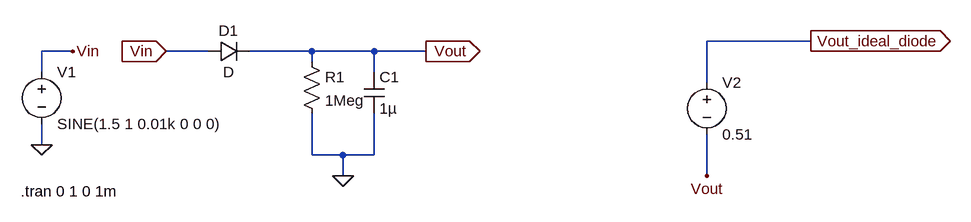
[diagram p0: schematic Peak detector Comm sys.asc]
Peak detector Comm sys.asc, the LTspice schematic file:
Version 4
SHEET 1 1344 680
WIRE 1040 96 880 96
WIRE -96 112 -144 112
WIRE 112 112 48 112
WIRE 272 112 176 112
WIRE 368 112 272 112
WIRE 448 112 368 112
WIRE 272 128 272 112
WIRE -144 144 -144 112
WIRE 368 144 368 112
WIRE 880 160 880 96
WIRE -144 256 -144 224
WIRE 272 272 272 208
WIRE 320 272 272 272
WIRE 368 272 368 208
WIRE 368 272 320 272
WIRE 320 304 320 272
WIRE 880 304 880 240
FLAG 320 304 0
FLAG 448 112 Vout
IOPIN 448 112 Out
FLAG 48 112 Vin
IOPIN 48 112 In
FLAG -144 256 0
FLAG -96 112 Vin
FLAG 880 304 Vout
FLAG 1040 96 Vout_ideal_diode
IOPIN 1040 96 Out
SYMBOL diode 112 128 R270
WINDOW 0 32 32 VTop 2
WINDOW 3 0 32 VBottom 2
SYMATTR InstName D1
SYMBOL res 256 112 R0
SYMATTR InstName R1
SYMATTR Value 1Meg
SYMBOL cap 352 144 R0
SYMATTR InstName C1
SYMATTR Value 1µ
SYMBOL voltage -144 128 R0
WINDOW 123 0 0 Left 0
WINDOW 39 0 0 Left 0
SYMATTR InstName V1
SYMATTR Value SINE(1.5 1 0.01k 0 0 0)
SYMBOL voltage 880 144 R0
WINDOW 123 0 0 Left 0
WINDOW 39 0 0 Left 0
SYMATTR InstName V2
SYMATTR Value 0.51
TEXT -176 328 Left 2 !.tran 0 1 0 1m

The netlist it stands for:
* Peak detector Comm sys.asc
D1 Vin Vout D
R1 Vout 0 1Meg
C1 Vout 0 1µ
V1 Vin 0 SINE(1.5 1 0.01k 0 0 0)
V2 Vout_ideal_diode Vout 0.51
.model D D
.lib standard.dio
.tran 0 1 0 1m
.backanno
.end